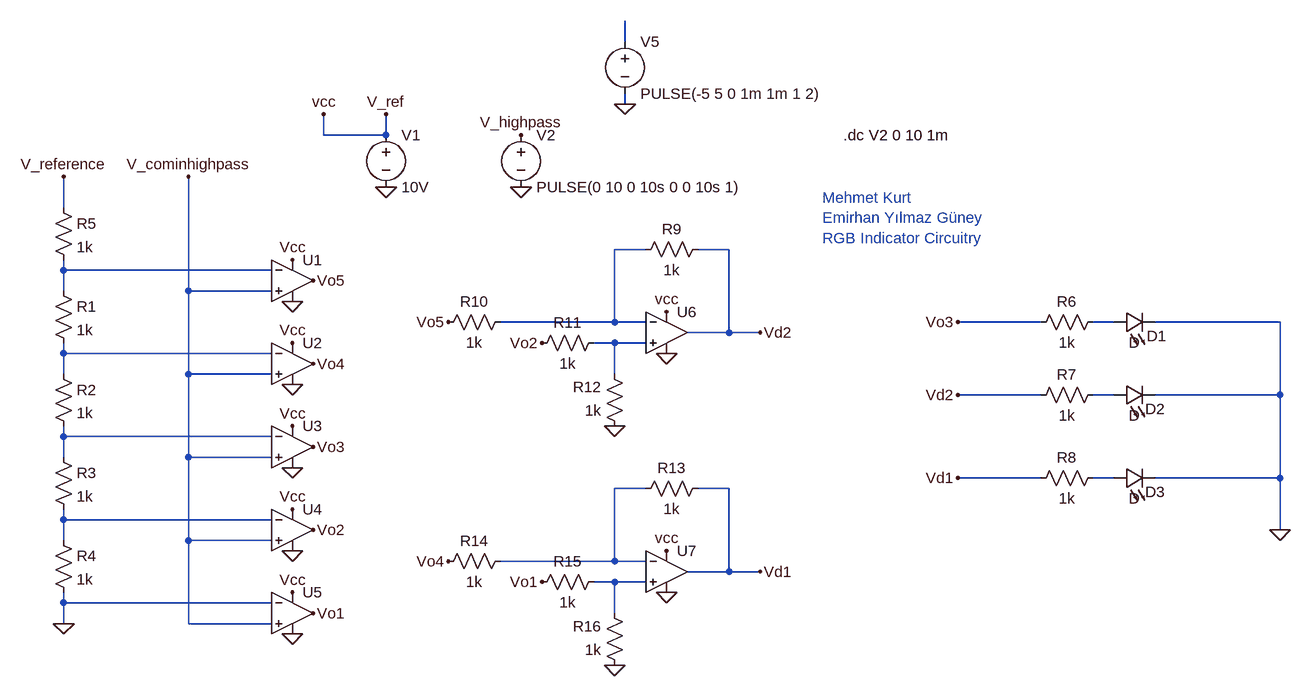
[diagram p0: schematic RGB Indicator Circuit.asc]
RGB Indicator Circuit.asc, the LTspice schematic file:
Version 4
SHEET 1 2384 980
WIRE 1104 -304 1104 -336
WIRE 1104 -208 1104 -224
WIRE 640 -160 640 -192
WIRE 736 -160 736 -192
WIRE 736 -160 640 -160
WIRE 240 -48 240 -96
WIRE 1136 16 1088 16
WIRE 1264 16 1216 16
WIRE 240 48 240 32
WIRE 560 48 240 48
WIRE 240 80 240 48
WIRE 432 80 432 -96
WIRE 560 80 432 80
WIRE 1088 128 1088 16
WIRE 1088 128 912 128
WIRE 1136 128 1088 128
WIRE 1744 128 1616 128
WIRE 1856 128 1824 128
WIRE 2112 128 1920 128
WIRE 1264 144 1264 16
WIRE 1264 144 1200 144
WIRE 1312 144 1264 144
WIRE 1088 160 1056 160
WIRE 1136 160 1088 160
WIRE 240 176 240 160
WIRE 560 176 240 176
WIRE 240 208 240 176
WIRE 432 208 432 80
WIRE 560 208 432 208
WIRE 1088 208 1088 160
WIRE 1744 240 1616 240
WIRE 1856 240 1824 240
WIRE 2112 240 2112 128
WIRE 2112 240 1920 240
WIRE 240 304 240 288
WIRE 560 304 240 304
WIRE 240 336 240 304
WIRE 432 336 432 208
WIRE 560 336 432 336
WIRE 1744 368 1616 368
WIRE 1856 368 1824 368
WIRE 2112 368 2112 240
WIRE 2112 368 1920 368
WIRE 1136 384 1088 384
WIRE 1264 384 1216 384
WIRE 240 432 240 416
WIRE 560 432 240 432
WIRE 2112 448 2112 368
WIRE 240 464 240 432
WIRE 432 464 432 336
WIRE 560 464 432 464
WIRE 1088 496 1088 384
WIRE 1088 496 912 496
WIRE 1136 496 1088 496
WIRE 1264 512 1264 384
WIRE 1264 512 1200 512
WIRE 1312 512 1264 512
WIRE 1088 528 1056 528
WIRE 1136 528 1088 528
WIRE 240 560 240 544
WIRE 560 560 240 560
WIRE 1088 576 1088 528
WIRE 240 592 240 560
WIRE 432 592 432 464
WIRE 560 592 432 592
FLAG 240 592 0
FLAG 592 608 0
FLAG 592 480 0
FLAG 592 352 0
FLAG 592 224 0
FLAG 592 96 0
FLAG 592 32 Vcc
FLAG 592 160 Vcc
FLAG 592 288 Vcc
FLAG 592 544 Vcc
FLAG 592 416 Vcc
FLAG 240 -96 V_reference
FLAG 432 -96 V_cominhighpass
FLAG 2112 448 0
FLAG 736 -80 0
FLAG 944 -80 0
FLAG 944 -160 V_highpass
FLAG 640 -192 vcc
FLAG 736 -192 V_ref
FLAG 1088 288 0
FLAG 1104 -208 0
FLAG 1088 656 0
FLAG 1168 112 vcc
FLAG 1168 480 vcc
FLAG 1168 176 0
FLAG 1168 544 0
FLAG 624 576 Vo1
FLAG 624 448 Vo2
FLAG 624 320 Vo3
FLAG 624 192 Vo4
FLAG 624 64 Vo5
FLAG 976 528 Vo1
FLAG 976 160 Vo2
FLAG 832 496 Vo4
FLAG 832 128 Vo5
FLAG 1312 512 Vd1
FLAG 1616 368 Vd1
FLAG 1616 240 Vd2
FLAG 1312 144 Vd2
FLAG 1616 128 Vo3
SYMBOL res 224 64 R0
SYMATTR InstName R1
SYMATTR Value 1k
SYMBOL res 224 192 R0
SYMATTR InstName R2
SYMATTR Value 1k
SYMBOL res 224 320 R0
SYMATTR InstName R3
SYMATTR Value 1k
SYMBOL res 224 448 R0
SYMATTR InstName R4
SYMATTR Value 1k
SYMBOL res 224 -64 R0
SYMATTR InstName R5
SYMATTR Value 1k
SYMBOL LED 1856 144 R270
WINDOW 0 -21 66 VTop 2
WINDOW 3 0 32 VBottom 2
SYMATTR InstName D1
SYMBOL LED 1856 256 R270
WINDOW 0 -21 64 VTop 2
WINDOW 3 0 32 VBottom 2
SYMATTR InstName D2
SYMBOL LED 1856 384 R270
WINDOW 0 -21 64 VTop 2
WINDOW 3 0 32 VBottom 2
SYMATTR InstName D3
SYMBOL res 1840 112 R90
WINDOW 0 0 56 VBottom 2
WINDOW 3 32 56 VTop 2
SYMATTR InstName R6
SYMATTR Value 1k
SYMBOL res 1840 224 R90
WINDOW 0 0 56 VBottom 2
WINDOW 3 32 56 VTop 2
SYMATTR InstName R7
SYMATTR Value 1k
SYMBOL res 1840 352 R90
WINDOW 0 0 56 VBottom 2
WINDOW 3 32 56 VTop 2
SYMATTR InstName R8
SYMATTR Value 1k
SYMBOL voltage 736 -176 R0
WINDOW 123 0 0 Left 0
WINDOW 39 0 0 Left 0
SYMATTR InstName V1
SYMATTR Value 10V
SYMBOL voltage 944 -176 R0
WINDOW 123 0 0 Left 0
WINDOW 39 0 0 Left 0
SYMATTR InstName V2
SYMATTR Value PULSE(0 10 0 10s 0 0 10s 1)
SYMBOL OpAmps\\UniversalOpAmp 1168 144 R0
SYMATTR InstName U6
SYMBOL res 1232 0 R90
WINDOW 0 0 56 VBottom 2
WINDOW 3 32 56 VTop 2
SYMATTR InstName R9
SYMATTR Value 1k
SYMBOL res 928 112 R90
WINDOW 0 0 56 VBottom 2
WINDOW 3 32 56 VTop 2
SYMATTR InstName R10
SYMATTR Value 1k
SYMBOL res 1072 144 R90
WINDOW 0 0 56 VBottom 2
WINDOW 3 32 56 VTop 2
SYMATTR InstName R11
SYMATTR Value 1k
SYMBOL res 1104 304 R180
WINDOW 0 36 76 Left 2
WINDOW 3 36 40 Left 2
SYMATTR InstName R12
SYMATTR Value 1k
SYMBOL voltage 1104 -320 R0
WINDOW 123 0 0 Left 0
WINDOW 39 0 0 Left 0
SYMATTR InstName V5
SYMATTR Value PULSE(-5 5 0 1m 1m 1 2)
SYMBOL OpAmps\\UniversalOpAmp2 592 64 R0
SYMATTR InstName U1
SYMBOL OpAmps\\UniversalOpAmp2 592 192 R0
SYMATTR InstName U2
SYMBOL OpAmps\\UniversalOpAmp2 592 320 R0
SYMATTR InstName U3
SYMBOL OpAmps\\UniversalOpAmp2 592 448 R0
SYMATTR InstName U4
SYMBOL OpAmps\\UniversalOpAmp2 592 576 R0
SYMATTR InstName U5
SYMBOL OpAmps\\UniversalOpAmp 1168 512 R0
SYMATTR InstName U7
SYMBOL res 1232 368 R90
WINDOW 0 0 56 VBottom 2
WINDOW 3 32 56 VTop 2
SYMATTR InstName R13
SYMATTR Value 1k
SYMBOL res 928 480 R90
WINDOW 0 0 56 VBottom 2
WINDOW 3 32 56 VTop 2
SYMATTR InstName R14
SYMATTR Value 1k
SYMBOL res 1072 512 R90
WINDOW 0 0 56 VBottom 2
WINDOW 3 32 56 VTop 2
SYMATTR InstName R15
SYMATTR Value 1k
SYMBOL res 1104 672 R180
WINDOW 0 36 76 Left 2
WINDOW 3 36 40 Left 2
SYMATTR InstName R16
SYMATTR Value 1k
TEXT 1440 -160 Left 2 !.dc V2 0 10 1m
TEXT 1408 -64 Left 2 ;Mehmet Kurt\nEmirhan Yılmaz Güney\nRGB Indicator Circuitry

The netlist it stands for:
* RGB Indicator Circuit.asc
R1 N003 N006 1k
R2 N006 N008 1k
R3 N008 N011 1k
R4 N011 0 1k
R5 V_reference N003 1k
D1 N004 0 D
D2 N007 0 D
D3 N009 0 D
R6 N004 Vo3 1k
R7 N007 Vd2 1k
R8 N009 Vd1 1k
V1 V_ref 0 10V
V2 V_highpass 0 PULSE(0 10 0 10s 0 0 10s 1)
XU6 N005 N002 V_ref 0 Vd2 level1 Avol=1Meg GBW=10Meg Vos=0 En=0 Enk=0 In=0 Ink=0 Rin=500Meg  ; pins In+ In- V+ V- OUT
R9 Vd2 N002 1k
R10 N002 Vo5 1k
R11 N005 Vo2 1k
R12 0 N005 1k
V5 N001 0 PULSE(-5 5 0 1m 1m 1 2)
XU1 V_cominhighpass N003 V_ref 0 Vo5 level2 Avol=1Meg GBW=10Meg Slew=10Meg Ilimit=25m Rail=0 Vos=0 En=0 Enk=0 In=0 Ink=0 Rin=500Meg  ; pins In+ In- V+ V- OUT
XU2 V_cominhighpass N006 V_ref 0 Vo4 level2 Avol=1Meg GBW=10Meg Slew=10Meg Ilimit=25m Rail=0 Vos=0 En=0 Enk=0 In=0 Ink=0 Rin=500Meg  ; pins In+ In- V+ V- OUT
XU3 V_cominhighpass N008 V_ref 0 Vo3 level2 Avol=1Meg GBW=10Meg Slew=10Meg Ilimit=25m Rail=0 Vos=0 En=0 Enk=0 In=0 Ink=0 Rin=500Meg  ; pins In+ In- V+ V- OUT
XU4 V_cominhighpass N011 V_ref 0 Vo2 level2 Avol=1Meg GBW=10Meg Slew=10Meg Ilimit=25m Rail=0 Vos=0 En=0 Enk=0 In=0 Ink=0 Rin=500Meg  ; pins In+ In- V+ V- OUT
XU5 V_cominhighpass 0 V_ref 0 Vo1 level2 Avol=1Meg GBW=10Meg Slew=10Meg Ilimit=25m Rail=0 Vos=0 En=0 Enk=0 In=0 Ink=0 Rin=500Meg  ; pins In+ In- V+ V- OUT
XU7 N012 N010 V_ref 0 Vd1 level1 Avol=1Meg GBW=10Meg Vos=0 En=0 Enk=0 In=0 Ink=0 Rin=500Meg  ; pins In+ In- V+ V- OUT
R13 Vd1 N010 1k
R14 N010 Vo4 1k
R15 N012 Vo1 1k
R16 0 N012 1k
.model D D
.lib standard.dio
.dc V2 0 10 1m
* Mehmet Kurt
* Emirhan Yılmaz Güney
* RGB Indicator Circuitry
.lib UniversalOpAmp1.lib
.lib UniversalOpAmp2.lib
.backanno
.end